# EAGLE design laser driver fet (EAGLE 7.2.0)
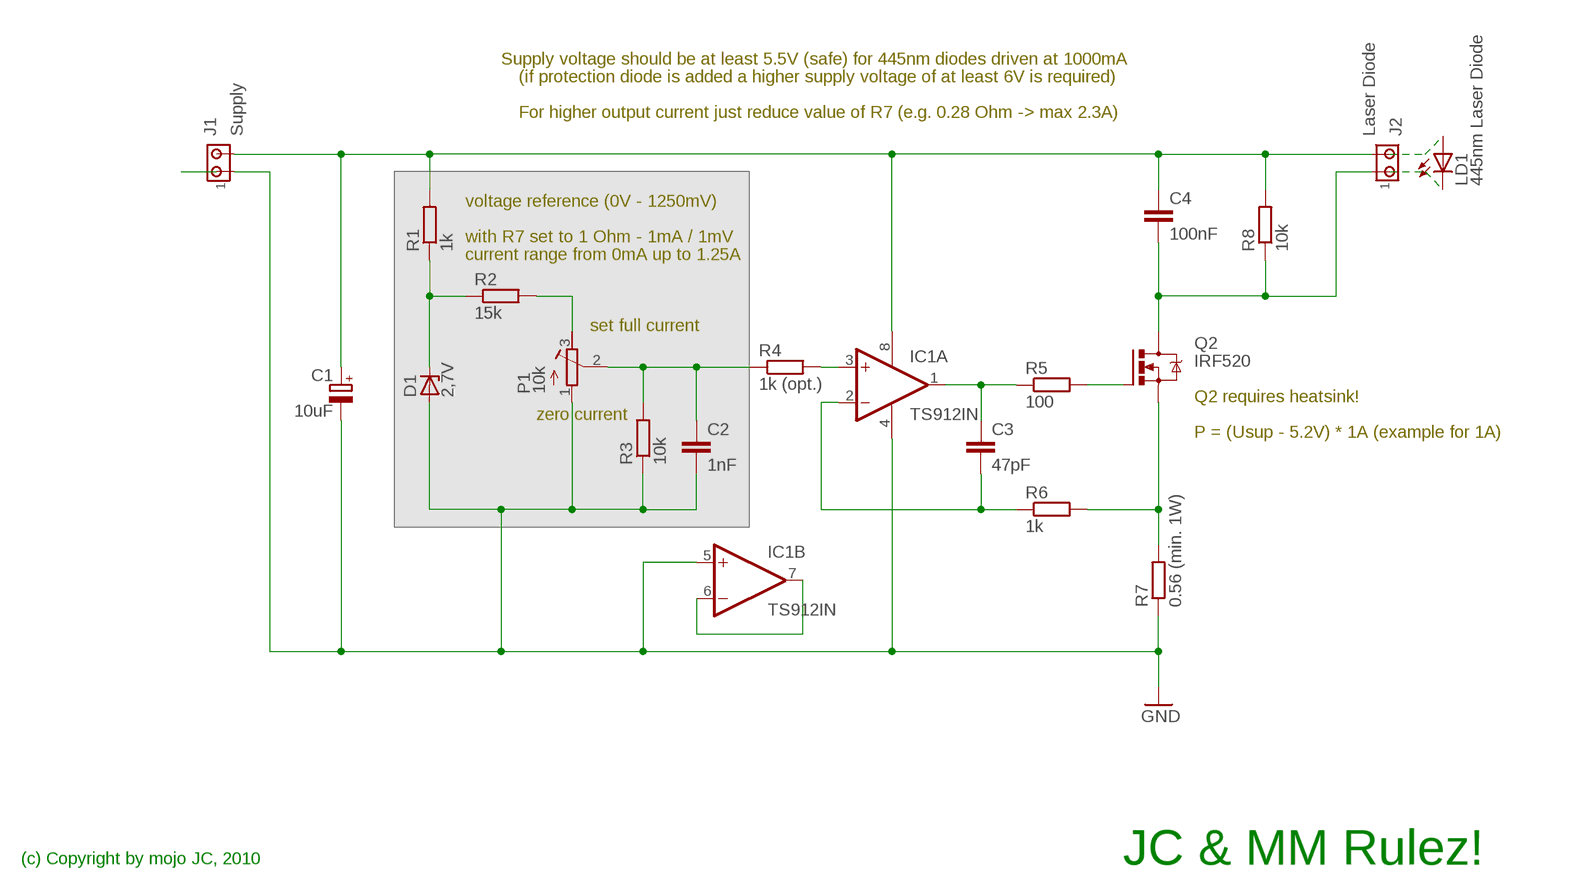
[diagram p0: schematic, sheet 1]

## Parts
C1  10uF  CPOL-EUE5-13  [E5-13]
C2  1nF  C2,5-3  [C2.5-3]
C3  47pF  C2,5-3  [C2.5-3]
C4  100nF  C2,5-3  [C2.5-3]
D1  2,7V  1N4728  [DO41Z10]
IC1  TS912IN  LM358N  [DIL08]
J1  Supply  MTA02-156  [1X2MTA]
J2  Laser Diode  MTA02-156  [1X2MTA]
LD1  445nm Laser Diode  LED5MM  [LED5MM]
P1  10k  R-TRIMM3296W  [RTRIM3296W]
Q2  IRF520  [TO220BV]
R1  1k  R-EU_0309/10  [0309/10]
R2  15k  R-EU_0309/10  [0309/10]
R3  10k  R-EU_0309/10  [0309/10]
R4  1k (opt.)  R-EU_0309/10  [0309/10]
R5  100  R-EU_0309/10  [0309/10]
R6  1k  R-EU_0309/10  [0309/10]
R7  0.56 (min. 1W)  R-EU_0411/3V  [0411V]
R8  10k  R-EU_0309/10  [0309/10]

## Nets
GND: C1.- C2.2 D1.A IC1.4(P:V-) IC1.5(B:+IN) J1.1 P1.1(E) R3.1 R7.1
N$1: D1.C R1.1 R2.1
N$2: C1.+ C4.1 IC1.8(P:V+) J1.2 J2.2 R1.2 R8.2
N$3: C4.2 J2.1 Q2.D R8.1
N$4: P1.3(A) R2.2
N$5: IC1.3(A:+IN) R4.2
N$6: C3.2 IC1.2(A:-IN) R6.1
N$7: Q2.S R6.2 R7.2
N$8: Q2.G R5.2
N$9: C3.1 IC1.1(A:OUT) R5.1
N$10: C2.1 P1.2(S) R3.2 R4.1
N$12: LD1.A
N$13: LD1.K(C)
N$17: IC1.6(B:-IN) IC1.7(B:OUT)

## Notes on the sheet
- Supply voltage should be at least 5.5V (safe) for 445nm diodes driven at 1000mA
- (if protection diode is added a higher supply voltage of at least 6V is required)
- For higher output current just reduce value of R7 (e.g. 0.28 Ohm -> max 2.3A)
- voltage reference (0V - 1250mV)
- with R7 set to 1 Ohm - 1mA / 1mV
- current range from 0mA up to 1.25A
- set full current
- Q2 requires heatsink!
- zero current
- P = (Usup - 5.2V) * 1A (example for 1A)
- (c) Copyright by mojo JC, 2010 | JC & MM Rulez!

## Library data of the parts
C1 = rcl:CPOL-EU: POLARIZED CAPACITOR, European symbol
C2-C4 = capacitor-wima:C: CAPACITOR naming: grid - package width
D1 = diode:1N4728: Z DIODE 3.3 V, 1W, 5 percent
IC1 = linear:LM358: OP AMP also LM158; LM258; LM2904 Source: http://cache.national.com/ds/LM/LM158.pdf
J1 J2 = con-amp:MTA02-156: AMP connector
LD1 = led:LED: LED OSRAM: - CHIPLED LG R971, LG N971, LY N971, LG Q971, LY Q971, LO R971, LY R971 LH N974, LH R974 LS Q976, LO Q976, LY Q976 LO Q996 - Hyper CHIPLED LW Q18S LB Q993, LB Q99A, LB R99A - SideLED LS A670, LO A670, LY A670, LG A670, LP A670 LB A673, LV A673, LT A673, LW A673 LH A674 LY A675 LS A676, LA A676, LO A676, LY A676, LW A676 LS A679, LY A679, LG A679 - Hyper Micro SIDELED® LS Y876, LA Y876, LO Y876, LY Y876 LT Y87S - SmartLED LW L88C, LW L88S LB L89C, LB L89S, LG L890 LS L89K, LO L89K, LY L89K LS L896, LA L896, LO L896, LY L896 - TOPLED LS T670, LO T670, LY T670, LG T670, LP T670 LSG T670, LSP T670, LSY T670, LOP T670, LYG T670 LG T671, LOG T671, LSG T671 LB T673, LV T673, LT T673, LW T673 LH T674 LS T676, LA T676, LO T676, LY T676, LB T676, LH T676, LSB T676, LW T676 LB T67C, LV T67C, LT T67C, LS T67K, LO T67K, LY T67K, LW E67C LS E67B, LA E67B, LO E67B, LY E67B, LB E67C, LV E67C, LT E67C LW T67C LS T679, LY T679, LG T679 LS T770, LO T770, LY T770, LG T770, LP T770 LB T773, LV T773, LT T773, LW T773 LH T774 LS E675, LA E675, LY E675, LS T675 LS T776, LA T776, LO T776, LY T776, LB T776 LHGB T686 LT T68C, LB T68C - Hyper Mini TOPLED® LB M676 - Mini TOPLED Santana® LG M470 LS M47K, LO M47K, LY M47K Source: http://www.osram.convergy.de LUXEON: - LUMILED® LXK2-PW12-R00, LXK2-PW12-S00, LXK2-PW14-U00, LXK2-PW14-V00 LXK2-PM12-R00, LXK2-PM12-S00, LXK2-PM14-U00 LXK2-PE12-Q00, LXK2-PE12-R00, LXK2-PE12-S00, LXK2-PE14-T00, LXK2-PE14-U00 LXK2-PB12-K00, LXK2-PB12-L00, LXK2-PB12-M00, LXK2-PB14-N00, LXK2-PB14-P00, LXK2-PB14-Q00 LXK2-PR12-L00, LXK2-PR12-M00, LXK2-PR14-Q00, LXK2-PR14-R00 LXK2-PD12-Q00, LXK2-PD12-R00, LXK2-PD12-S00 LXK2-PH12-R00, LXK2-PH12-S00 LXK2-PL12-P00, LXK2-PL12-Q00, LXK2-PL12-R00 Source: www.luxeon.com KINGBRIGHT: KA-3528ASYC Source: www.kingbright.com
P1 = rcl:R-TRIMM: Trimm resistor
Q2 = transistor-power:IRF520: HEXFET Power MOSFET
R1-R8 = rcl:R-EU_: RESISTOR, European symbol

## Board
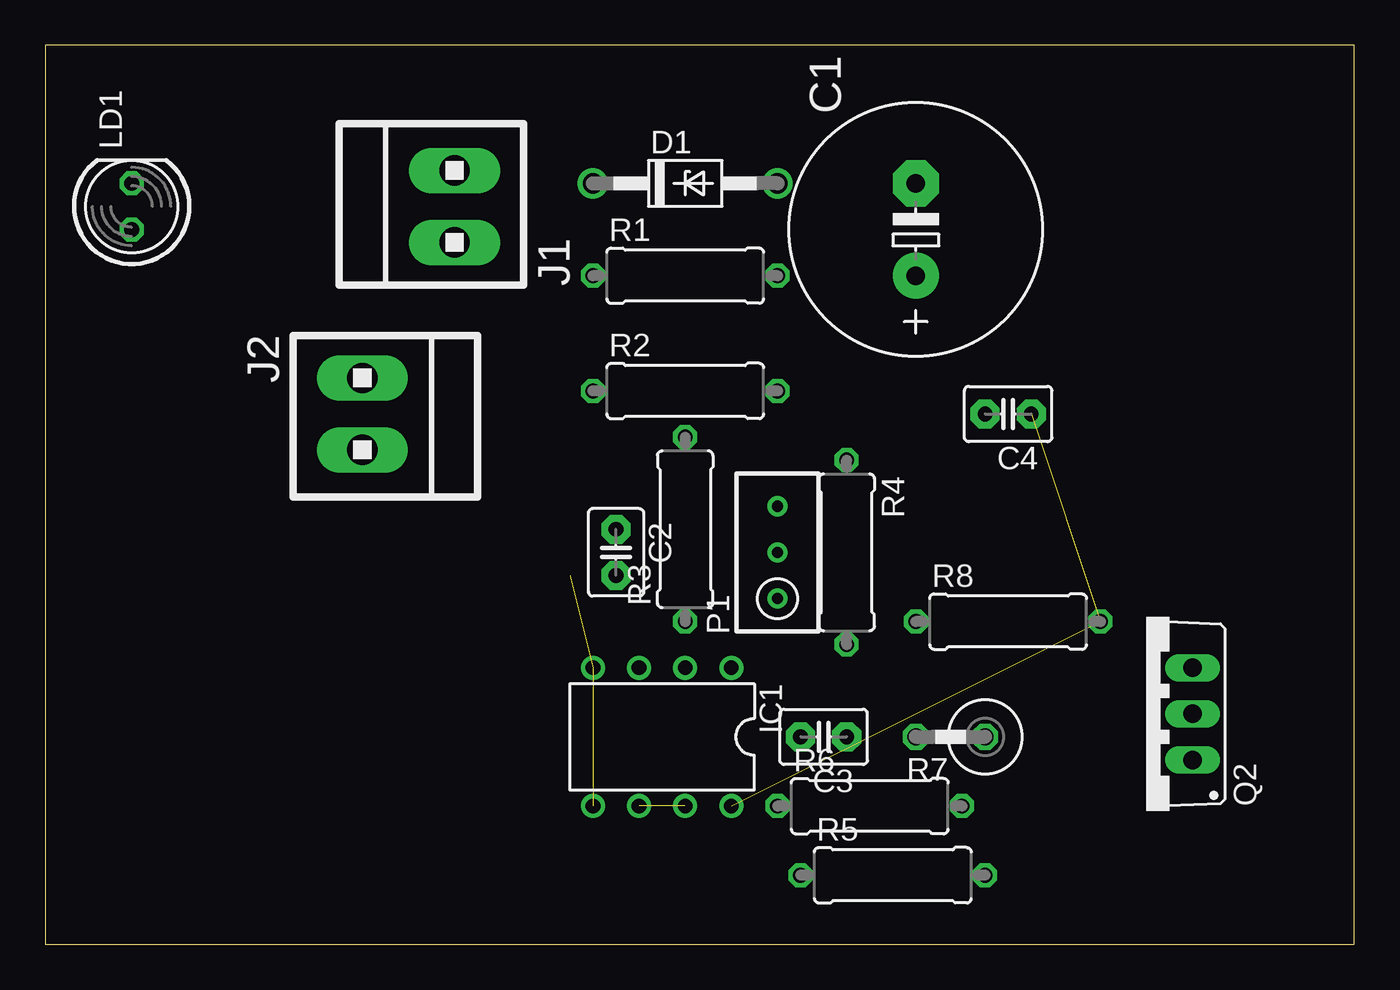
[diagram p1: board, top side]
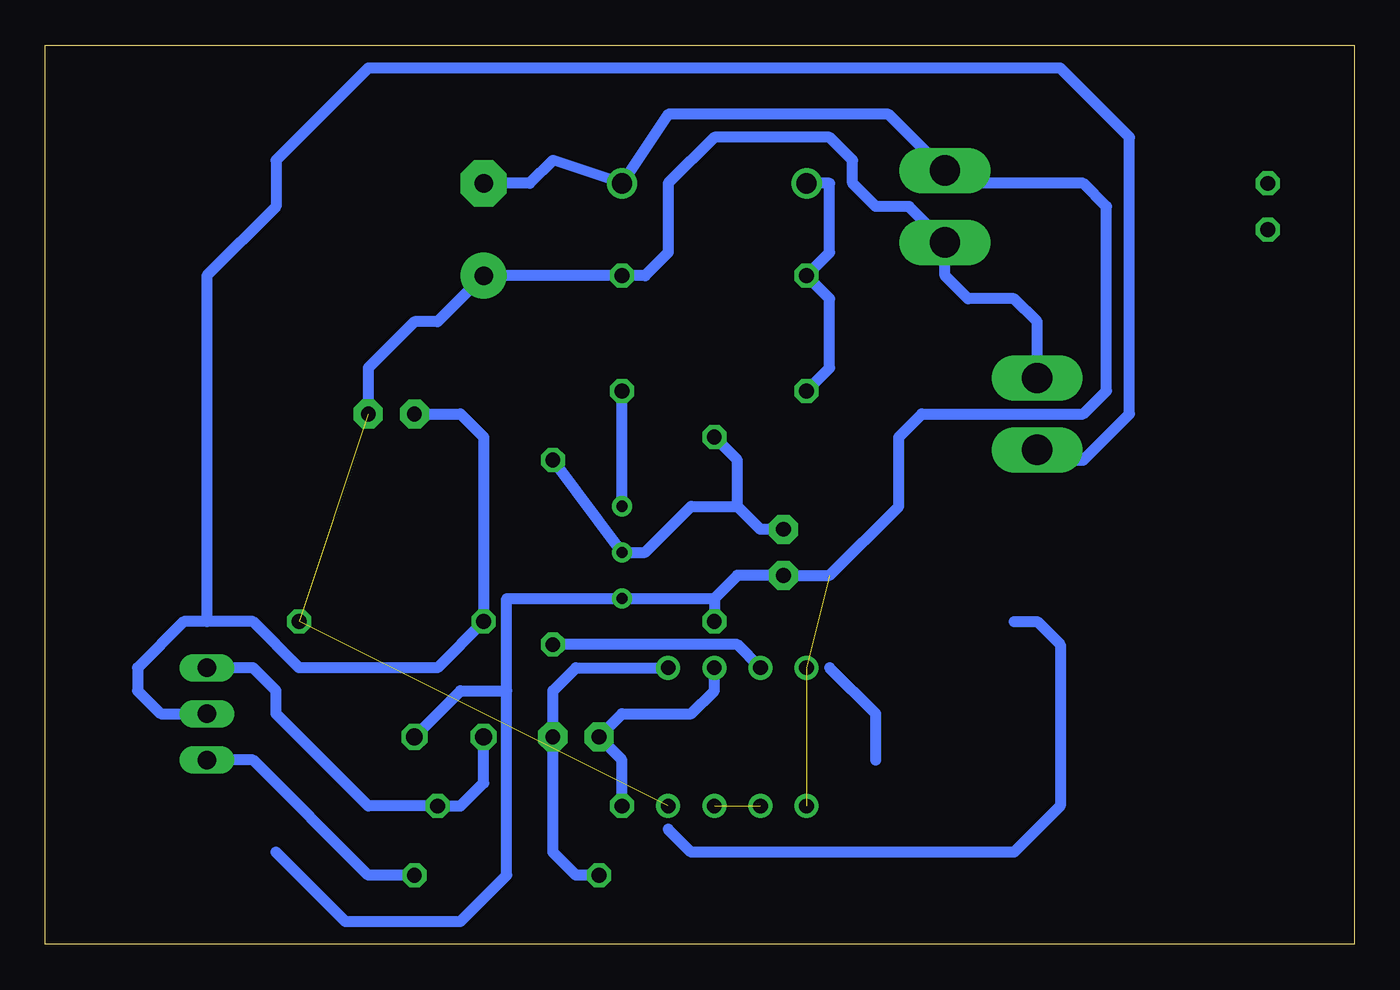
[diagram p2: board, bottom side, seen from below]

Size 72.06 x 49.51 mm. Coordinates in mm from the lower left corner, seen from the top.
Outline: 72.06,0 72.06,49.51 0,49.51 0,0 72.06,0
Copper layers (1*16): Top 0.035mm / dielectric 1.5mm / Bottom 0.035mm
Design rules "default": minimum track width 10mil, minimum drill 24mil, track to track 8mil, track to pad 8mil, pad to pad 8mil, via to via 8mil, smd to smd 8mil, copper to edge 40mil, drill to drill 8mil, minimum pad ring 10mil, minimum via ring 8mil, stop-mask expansion 4mil, vias tented up to drill 0mil, thermal gap 10mil

### Footprints (pad centres in the part's own frame; a part is rotated, then mirrored left to right if it is on the bottom)
E5-13 = drill 1.016 pad 2.54: + -2.54,0 | drill 1.016 pad 2.54 octagon: - 2.54,0
C2.5-3 = drill 0.813 pad 1.6 octagon: 1 -1.27,0; 2 1.27,0
DO41Z10 = drill 1.118: A 5.08,0; C -5.08,0
DIL08 = drill 0.813 pad 1.27: 1 -3.81,-3.81; 2 -1.27,-3.81; 3 1.27,-3.81; 4 3.81,-3.81; 5 3.81,3.81; 6 1.27,3.81; 7 -1.27,3.81; 8 -3.81,3.81
1X2MTA = drill 1.676 long: 1 1.981,0; 2 -1.981,0
LED5MM = drill 0.813 octagon: A -1.27,0; K 1.27,0
RTRIM3296W = drill 0.61: 1 0,-2.54; 2 0,0; 3 0,2.54
TO220BV = drill 1.016 long: D 0,-2.54; G -2.54,-2.54; S 2.54,-2.54
0309/10 = drill 0.813 octagon: 1 -5.08,0; 2 5.08,0
0411V = drill 0.914 octagon: 1 -2.54,0; 2 1.27,0

### Placement (x,y rotation side)
C1  47.93,39.37 90 top
C2  31.42,21.59 270 top
C3  42.85,11.43 180 top
C4  53.01,29.21 180 top
D1  35.23,41.91 0 top
IC1  33.96,11.43 180 top
J1  22.53,40.64 90 top
J2  17.45,29.21 270 top
LD1  4.75,40.64 90 top
P1  40.31,21.59 0 top
Q2  60.63,12.7 90 top
R1  35.23,36.83 0 top
R2  35.23,30.48 0 top
R3  35.23,22.86 90 top
R4  44.12,21.59 270 top
R5  46.66,3.81 0 top
R6  45.39,7.62 0 top
R7  49.2,11.43 180 top
R8  53.01,17.78 0 top

### Tracks (layer width: path | path; a pad name or v marks a point on that pad's centre or on a via)
GND  (2 unrouted)
  Bottom 0.61: C1.- 45.39,41.91 44.12,43.18 D1.A 37.77,45.72 25.63,45.72 J1.1 21.97,42.62 21.26,41.91 14.91,41.91 13.64,40.64 13.64,30.48 14.91,29.21 23.8,29.21 25.07,27.94 25.07,24.13 28.88,20.32 C2.2 33.96,20.32 35.23,19.05 | 35.23,19.05 P1.1 46.66,19.05 46.66,13.97 | 35.23,19.05 R3.1 | R7.1 49.2,13.97 46.66,13.97 | 59.36,5.08 55.55,1.27 49.2,1.27 46.66,3.81 46.66,13.97
N$1
  Bottom 0.61: R2.1 28.88,31.75 28.88,35.56 R1.1 28.88,38.1 28.88,41.91 D1.C
N$2  (2 unrouted)
  Bottom 0.61: J2.2 17.45,34.29 18.72,35.56 21.26,35.56 22.53,36.83 J1.2 24.51,40.64 26.34,40.64 27.61,41.91 27.61,43.18 28.88,44.45 35.23,44.45 37.77,41.91 37.77,38.1 39.04,36.83 R1.2 C1.+ 50.47,34.29 51.74,34.29 54.28,31.75 C4.1
N$3
  Bottom 0.61: C4.2 49.2,29.21 47.93,27.94 R8.1 50.47,15.24 58.09,15.24 60.63,17.78 63.17,17.78 | 63.17,17.78 64.44,17.78 66.98,15.24 66.98,13.97 65.71,12.7 Q2.D | J2.1 16.89,26.67 14.91,26.67 12.37,29.21 12.37,44.45 16.18,48.26 54.28,48.26 59.36,43.18 59.36,40.64 63.17,36.83 63.17,17.78
N$4
  Bottom 0.61: P1.3 R2.2
N$5
  Bottom 0.61: IC1.3 33.96,16.51 R4.2
N$6
  Bottom 0.61: R6.1 40.31,10.16 C3.2 40.31,12.7 36.5,12.7 35.23,13.97 IC1.2
N$7
  Bottom 0.61: R7.2 47.93,8.89 49.2,7.62 R6.2 54.28,7.62 59.36,12.7 59.36,13.97 60.63,15.24 Q2.S
N$8
  Bottom 0.61: R5.2 54.28,3.81 60.63,10.16 Q2.G
N$9
  Bottom 0.61: R5.1 42.85,3.81 44.12,5.08 C3.1 44.12,13.97 42.85,15.24 IC1.1
N$10
  Bottom 0.61: R4.1 P1.2 39.04,21.59 36.5,24.13 33.96,24.13 | C2.1 32.69,22.86 33.96,24.13 | 33.96,24.13 33.96,26.67 R3.2
N$17  (1 unrouted)
V+
  Bottom 0.61: 18.72,17.78 17.45,17.78 16.18,16.51 16.18,7.62 18.72,5.08 36.5,5.08 37.77,6.35
V-
  Bottom 0.61: 26.34,10.16 26.34,12.7 28.88,15.24